# Altium schematic sheet Display_Driver.SchDoc
size 594 x 420 mm; SheetNumber: 3; SheetTotal: 4
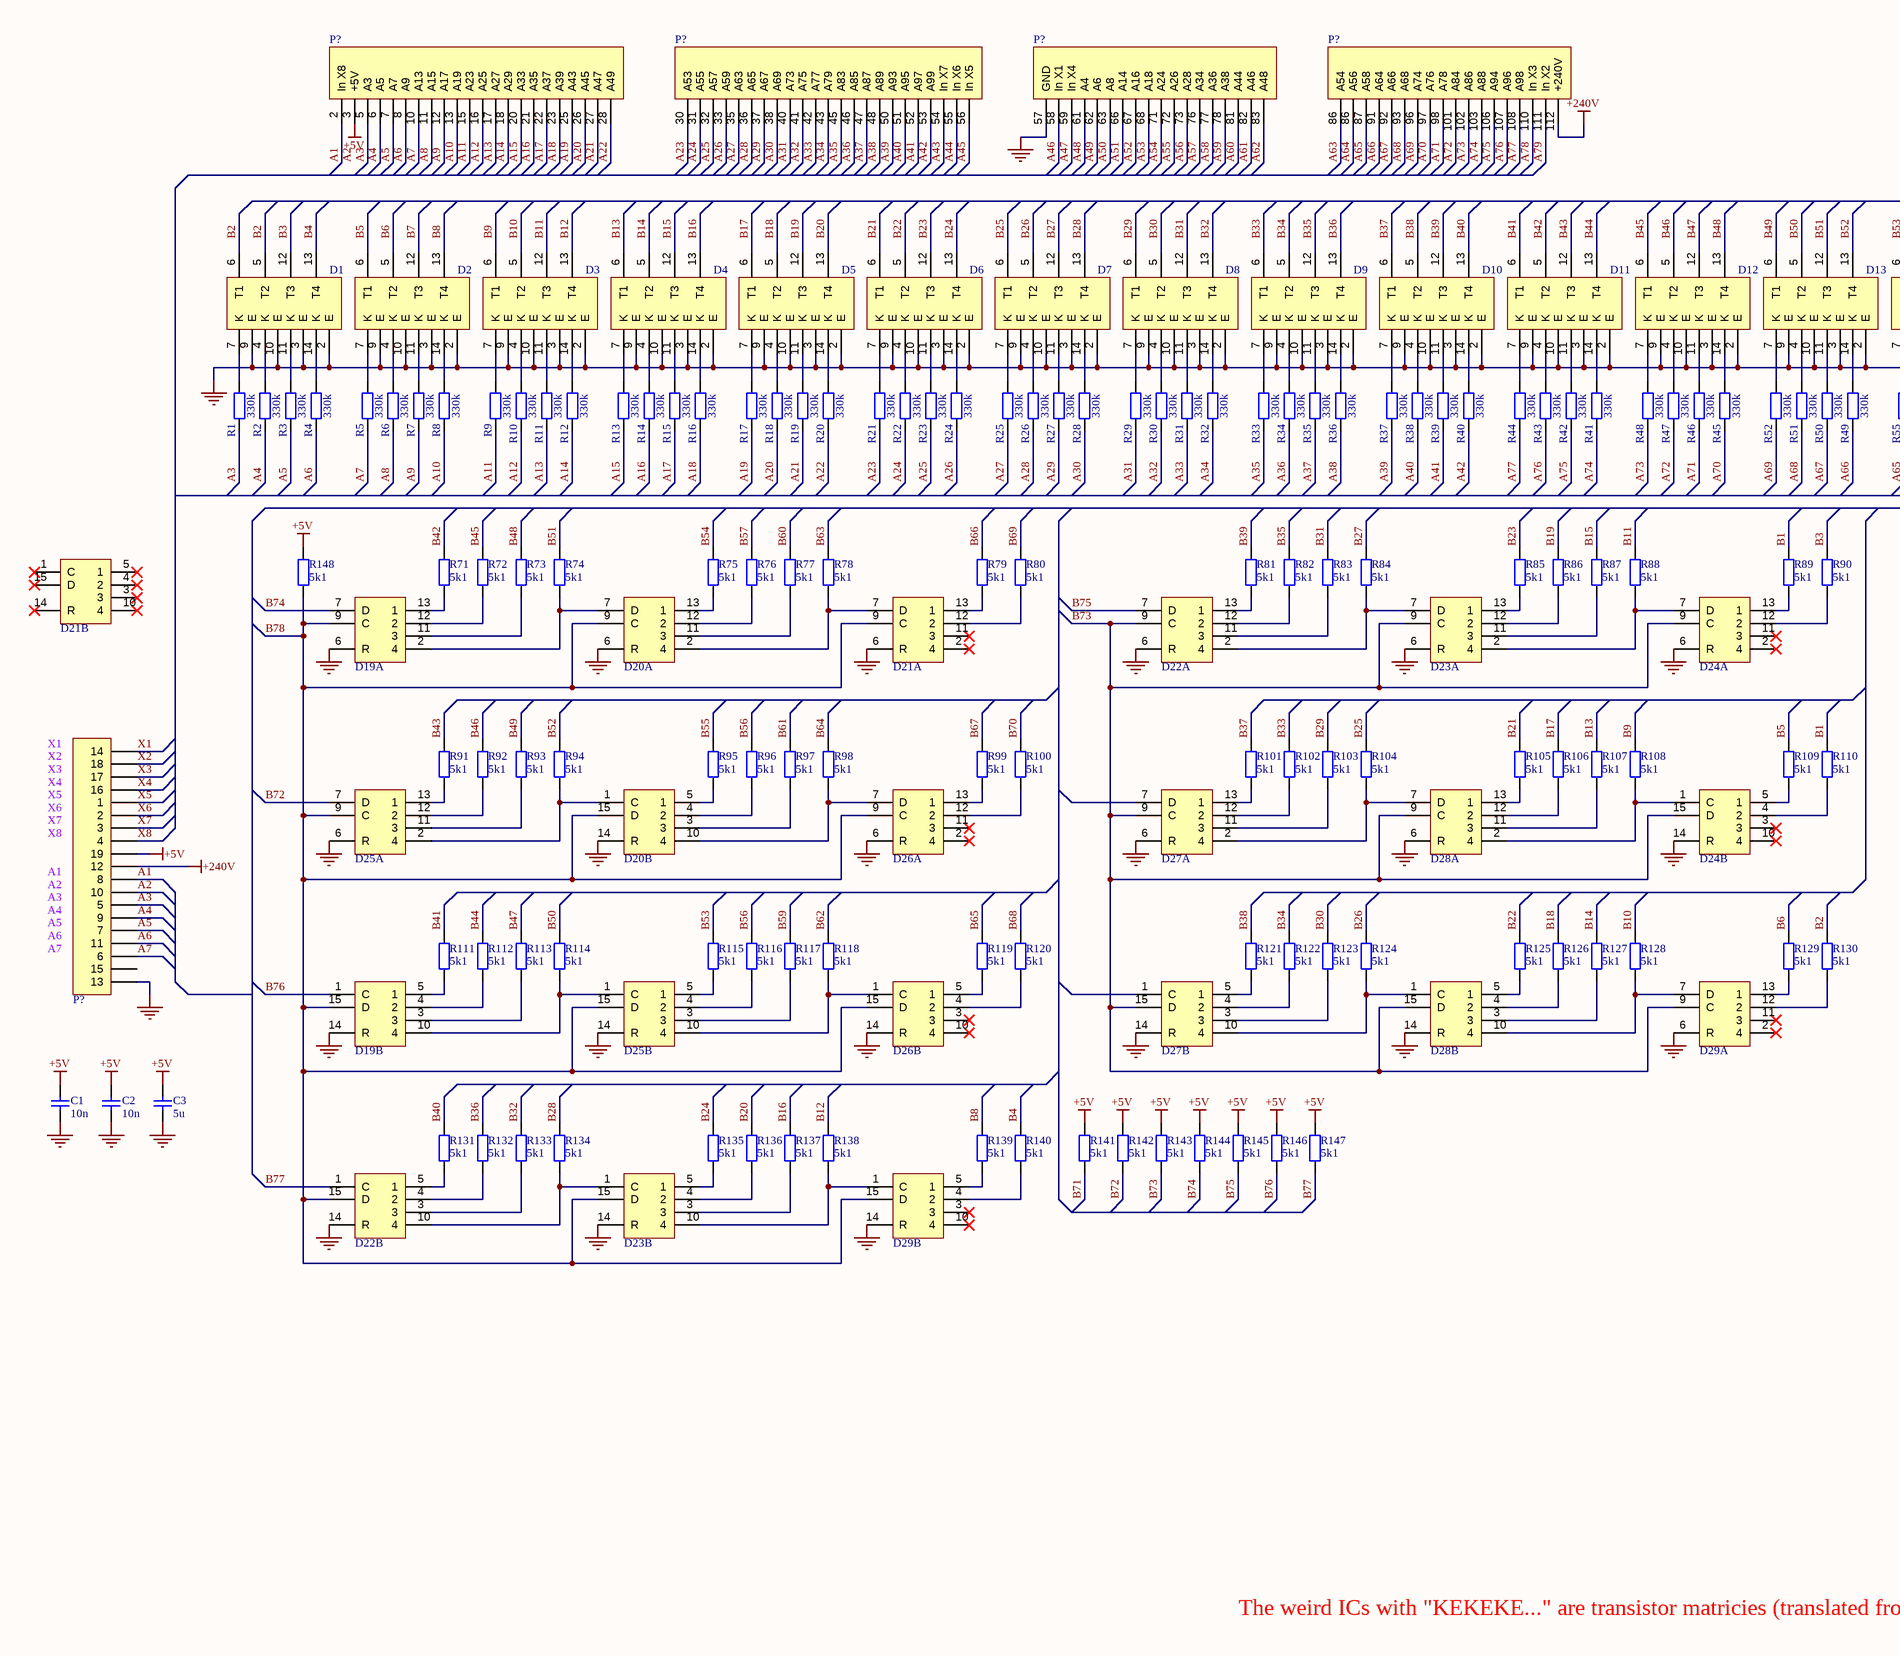
[diagram p0: Display_Driver.SchDoc, left]
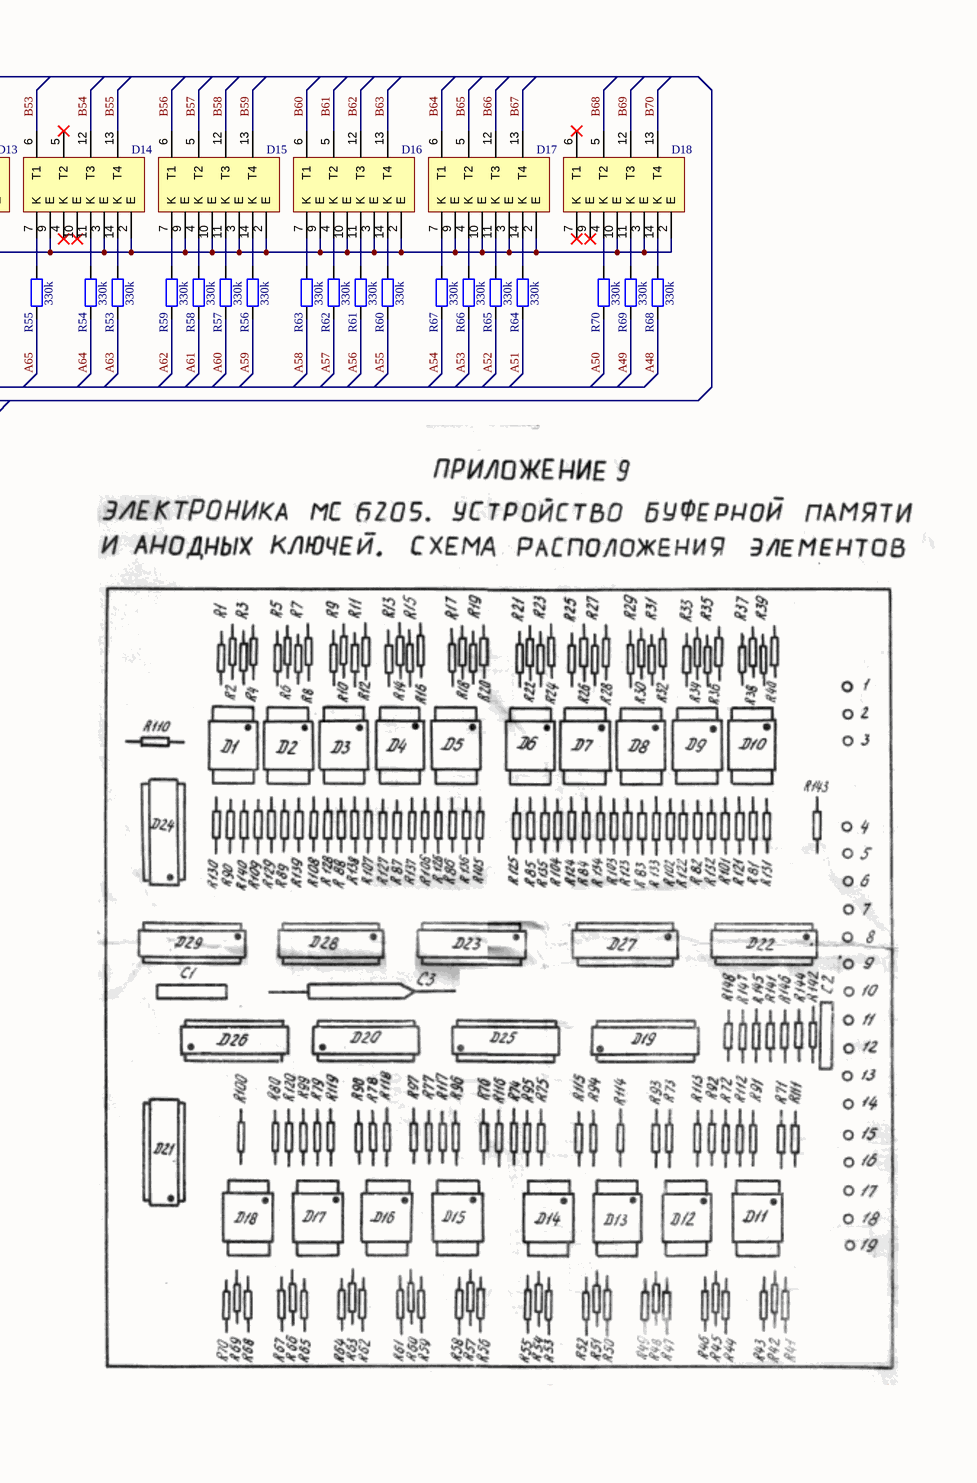
[diagram p1: Display_Driver.SchDoc, right]

## Parts
(Parts that share a designator on the sheet are numbered #1, #2 ... from top to bottom, then left to right.)
C1  10n
C2  10n
C3  5u
D1  -  (value not drawn)
D2  -  (value not drawn)
D3  -  (value not drawn)
D4  -  (value not drawn)
D5  -  (value not drawn)
D6  -  (value not drawn)
D7  -  (value not drawn)
D8  -  (value not drawn)
D9  -  (value not drawn)
D10  -  (value not drawn)
D11  -  (value not drawn)
D12  -  (value not drawn)
D13  -  (value not drawn)
D14  -  (value not drawn)
D15  -  (value not drawn)
D16  -  (value not drawn)
D17  -  (value not drawn)
D18  -  (value not drawn)
D19  -  (value not drawn)  (parts A,B of 2)
D20  -  (value not drawn)  (parts A,B of 2)
D21  -  (value not drawn)  (parts A,B of 2)
D22  -  (value not drawn)  (parts A,B of 2)
D23  -  (value not drawn)  (parts A,B of 2)
D24  -  (value not drawn)  (parts A,B of 2)
D25  -  (value not drawn)  (parts A,B of 2)
D26  -  (value not drawn)  (parts A,B of 2)
D27  -  (value not drawn)  (parts A,B of 2)
D28  -  (value not drawn)  (parts A,B of 2)
D29  -  (value not drawn)  (parts A,B of 2)
P?#1  -  (value not drawn)
P?#2  -  (value not drawn)
P?#3  -  (value not drawn)
P?#4  -  (value not drawn)
P?#5  -  (value not drawn)
R1  330k
R2  330k
R3  330k
R4  330k
R5  330k
R6  330k
R7  330k
R8  330k
R9  330k
R10  330k
R11  330k
R12  330k
R13  330k
R14  330k
R15  330k
R16  330k
R17  330k
R18  330k
R19  330k
R20  330k
R21  330k
R22  330k
R23  330k
R24  330k
R25  330k
R26  330k
R27  330k
R28  330k
R29  330k
R30  330k
R31  330k
R32  330k
R33  330k
R34  330k
R35  330k
R36  330k
R37  330k
R38  330k
R39  330k
R40  330k
R41  330k
R42  330k
R43  330k
R44  330k
R45  330k
R46  330k
R47  330k
R48  330k
R49  330k
R50  330k
R51  330k
R52  330k
R53  330k
R54  330k
R55  330k
R56  330k
R57  330k
R58  330k
R59  330k
R60  330k
R61  330k
R62  330k
R63  330k
R64  330k
R65  330k
R66  330k
R67  330k
R68  330k
R69  330k
R70  330k
R71  5k1
R72  5k1
R73  5k1
R74  5k1
R75  5k1
R76  5k1
R77  5k1
R78  5k1
R79  5k1
R80  5k1
R81  5k1
R82  5k1
R83  5k1
R84  5k1
R85  5k1
R86  5k1
R87  5k1
R88  5k1
R89  5k1
R90  5k1
R91  5k1
R92  5k1
R93  5k1
R94  5k1
R95  5k1
R96  5k1
R97  5k1
R98  5k1
R99  5k1
R100  5k1
R101  5k1
R102  5k1
R103  5k1
R104  5k1
R105  5k1
R106  5k1
R107  5k1
R108  5k1
R109  5k1
R110  5k1
R111  5k1
R112  5k1
R113  5k1
R114  5k1
R115  5k1
R116  5k1
R117  5k1
R118  5k1
R119  5k1
R120  5k1
R121  5k1
R122  5k1
R123  5k1
R124  5k1
R125  5k1
R126  5k1
R127  5k1
R128  5k1
R129  5k1
R130  5k1
R131  5k1
R132  5k1
R133  5k1
R134  5k1
R135  5k1
R136  5k1
R137  5k1
R138  5k1
R139  5k1
R140  5k1
R141  5k1
R142  5k1
R143  5k1
R144  5k1
R145  5k1
R146  5k1
R147  5k1
R148  5k1

## Nets
+5V: C1.1 C2.1 C3.1 P?#1.3(+5V) P?#5.19 R141.1 R142.1 R143.1 R144.1 R145.1 R146.1 R147.1 R148.2
+240V: P?#4.112(+240V) P?#5.12
GND: C1.2 C2.2 C3.2 D1.2(E) D1.3(E) D1.9(E) D1.10(E) D2.2(E) D2.3(E) D2.9(E) D2.10(E) D3.2(E) D3.3(E) D3.9(E) D3.10(E) D4.2(E) D4.3(E) D4.9(E) D4.10(E) D5.2(E) D5.3(E) D5.9(E) D5.10(E) D6.2(E) D6.3(E) D6.9(E) D6.10(E) D7.2(E) D7.3(E) D7.9(E) D7.10(E) D8.2(E) D8.3(E) D8.9(E) D8.10(E) D9.2(E) D9.3(E) D9.9(E) D9.10(E) D10.2(E) D10.3(E) D10.9(E) D10.10(E) D11.2(E) D11.3(E) D11.9(E) D11.10(E) D12.2(E) D12.3(E) D12.9(E) D12.10(E) D13.2(E) D13.3(E) D13.9(E) D13.10(E) D14.2(E) D14.3(E) D14.9(E) D15.2(E) D15.3(E) D15.9(E) D15.10(E) D16.2(E) D16.3(E) D16.9(E) D16.10(E) D17.2(E) D17.3(E) D17.9(E) D17.10(E) D18.2(E) D18.3(E) D18.10(E) D19.6(R) D19.14(R) D20.6(R) D20.14(R) D21.6(R) D22.6(R) D22.14(R) D23.6(R) D23.14(R) D24.6(R) D24.14(R) D25.6(R) D25.14(R) D26.6(R) D26.14(R) D27.6(R) D27.14(R) D28.6(R) D28.14(R) D29.6(R) D29.14(R) P?#3.57(GND) P?#5.13
A1: P?#1.2(In_X8) P?#5.8
A2: P?#5.10
A3: P?#1.5(A3) P?#5.5 R1.1
A4: P?#1.6(A5) P?#5.9 R2.1
A5: P?#1.7(A7) P?#5.7 R3.1
A6: P?#1.8(A9) P?#5.11 R4.1
A7: P?#1.10(A13) P?#5.6 R5.1
A8: P?#1.11(A15) R6.1
A9: P?#1.12(A17) R7.1
A10: P?#1.13(A19) R8.1
A11: P?#1.15(A23) R9.1
A12: P?#1.16(A25) R10.1
A13: P?#1.17(A27) R11.1
A14: P?#1.18(A29) R12.1
A15: P?#1.20(A33) R13.1
A16: P?#1.21(A35) R14.1
A17: P?#1.22(A37) R15.1
A18: P?#1.23(A39) R16.1
A19: P?#1.25(A43) R17.1
A20: P?#1.26(A45) R18.1
A21: P?#1.27(A47) R19.1
A22: P?#1.28(A49) R20.1
A23: P?#2.30(A53) R21.1
A24: P?#2.31(A55) R22.1
A25: P?#2.32(A57) R23.1
A26: P?#2.33(A59) R24.1
A27: P?#2.35(A63) R25.1
A28: P?#2.36(A65) R26.1
A29: P?#2.37(A67) R27.1
A30: P?#2.38(A69) R28.1
A31: P?#2.40(A73) R29.1
A32: P?#2.41(A75) R30.1
A33: P?#2.42(A77) R31.1
A34: P?#2.43(A79) R32.1
A35: P?#2.45(A83) R33.1
A36: P?#2.46(A85) R34.1
A37: P?#2.47(A87) R35.1
A38: P?#2.48(A89) R36.1
A39: P?#2.50(A93) R37.1
A40: P?#2.51(A95) R38.1
A41: P?#2.52(A97) R39.1
A42: P?#2.53(A99) R40.1
A43: P?#2.54(In_X7)
A44: P?#2.55(In_X6)
A45: P?#2.56(In_X5)
A46: P?#3.58(In_X1)
A47: P?#3.59(In_X4)
A48: P?#3.61(A4) R68.1
A49: P?#3.62(A6) R69.1
A50: P?#3.63(A8) R70.1
A51: P?#3.66(A14) R64.1
A52: P?#3.67(A16) R65.1
A53: P?#3.68(A18) R66.1
A54: P?#3.71(A24) R67.1
A55: P?#3.72(A26) R60.1
A56: P?#3.73(A28) R61.1
A57: P?#3.76(A34) R62.1
A58: P?#3.77(A36) R63.1
A59: P?#3.78(A38) R56.1
A60: P?#3.81(A44) R57.1
A61: P?#3.82(A46) R58.1
A62: P?#3.83(A48) R59.1
A63: P?#4.86(A54) R53.1
A64: P?#4.86(A56) R54.1
A65: P?#4.87(A58) R55.1
A66: P?#4.91(A64) R49.1
A67: P?#4.92(A66) R50.1
A68: P?#4.93(A68) R51.1
A69: P?#4.96(A74) R52.1
A70: P?#4.97(A76) R45.1
A71: P?#4.98(A78) R46.1
A72: P?#4.101(A84) R47.1
A73: P?#4.102(A86) R48.1
A74: P?#4.103(A88) R41.1
A75: P?#4.106(A94) R42.1
A76: P?#4.107(A96) R43.1
A77: P?#4.108(A98) R44.1
A78: P?#4.110(In_X3)
A79: P?#4.111(In_X2)
B1: R89.2 R110.2
B2: D1.5(T2) D1.6(T1) R130.2
B3: D1.12(T3) R90.2
B4: D1.13(T4) R140.2
B5: D2.6(T1) R109.2
B6: D2.5(T2) R129.2
B7: D2.12(T3)
B8: D2.13(T4) R139.2
B9: D3.6(T1) R108.2
B10: D3.5(T2) R128.2
B11: D3.12(T3) R88.2
B12: D3.13(T4) R138.2
B13: D4.6(T1) R107.2
B14: D4.5(T2) R127.2
B15: D4.12(T3) R87.2
B16: D4.13(T4) R137.2
B17: D5.6(T1) R106.2
B18: D5.5(T2) R126.2
B19: D5.12(T3) R86.2
B20: D5.13(T4) R136.2
B21: D6.6(T1) R105.2
B22: D6.5(T2) R125.2
B23: D6.12(T3) R85.2
B24: D6.13(T4) R135.2
B25: D7.6(T1) R104.2
B26: D7.5(T2) R124.2
B27: D7.12(T3) R84.2
B28: D7.13(T4) R134.2
B29: D8.6(T1) R103.2
B30: D8.5(T2) R123.2
B31: D8.12(T3) R83.2
B32: D8.13(T4) R133.2
B33: D9.6(T1) R102.2
B34: D9.5(T2) R122.2
B35: D9.12(T3) R82.2
B36: D9.13(T4) R132.2
B37: D10.6(T1) R101.2
B38: D10.5(T2) R121.2
B39: D10.12(T3) R81.2
B40: D10.13(T4) R131.2
B41: D11.6(T1) R111.2
B42: D11.5(T2) R71.2
B43: D11.12(T3) R91.2
B44: D11.13(T4) R112.2
B45: D12.6(T1) R72.2
B46: D12.5(T2) R92.2
B47: D12.12(T3) R113.2
B48: D12.13(T4) R73.2
B49: D13.6(T1) R93.2
B50: D13.5(T2) R114.2
B51: D13.12(T3) R74.2
B52: D13.13(T4) R94.2
B53: D14.6(T1) R115.2
B54: D14.12(T3) R75.2
B55: D14.13(T4) R95.2
B56: D15.6(T1) R96.2 R116.2
B57: D15.5(T2) R76.2
B58: D15.12(T3)
B59: D15.13(T4) R117.2
B60: D16.6(T1) R77.2
B61: D16.5(T2) R97.2
B62: D16.12(T3) R118.2
B63: D16.13(T4) R78.2
B64: D17.6(T1) R98.2
B65: D17.5(T2) R119.2
B66: D17.12(T3) R79.2
B67: D17.13(T4) R99.2
B68: D18.5(T2) R120.2
B69: D18.12(T3) R80.2
B70: D18.13(T4) R100.2
B71: R141.2
B72: D25.7(D) R142.2
B73: D22.9(C) D23.9(C) D24.9(C) D24.15(D) D27.9(C) D27.15(D) D28.9(C) D28.15(D) D29.9(C) R143.2
B74: D19.7(D) R144.2
B75: D22.7(D) R145.2
B76: D19.1(C) R146.2
B77: D22.1(C) R147.2
B78: D19.9(C) D19.15(D) D20.9(C) D20.15(D) D21.9(C) D22.15(D) D23.15(D) D25.9(C) D25.15(D) D26.9(C) D26.15(D) D29.15(D) R148.1
X1: P?#5.14
X2: P?#5.18
X3: P?#5.17
X4: P?#5.16
X5: P?#5.1
X6: P?#5.2
X7: P?#5.3
X8: P?#5.4
NetD1_4: D1.4(K) R2.2
NetD1_7: D1.7(K) R1.2
NetD1_11: D1.11(K) R3.2
NetD1_14: D1.14(K) R4.2
NetD2_4: D2.4(K) R6.2
NetD2_7: D2.7(K) R5.2
NetD2_11: D2.11(K) R7.2
NetD2_14: D2.14(K) R8.2
NetD3_4: D3.4(K) R10.2
NetD3_7: D3.7(K) R9.2
NetD3_11: D3.11(K) R11.2
NetD3_14: D3.14(K) R12.2
NetD4_4: D4.4(K) R14.2
NetD4_7: D4.7(K) R13.2
NetD4_11: D4.11(K) R15.2
NetD4_14: D4.14(K) R16.2
NetD5_4: D5.4(K) R18.2
NetD5_7: D5.7(K) R17.2
NetD5_11: D5.11(K) R19.2
NetD5_14: D5.14(K) R20.2
NetD6_4: D6.4(K) R22.2
NetD6_7: D6.7(K) R21.2
NetD6_11: D6.11(K) R23.2
NetD6_14: D6.14(K) R24.2
NetD7_4: D7.4(K) R26.2
NetD7_7: D7.7(K) R25.2
NetD7_11: D7.11(K) R27.2
NetD7_14: D7.14(K) R28.2
NetD8_4: D8.4(K) R30.2
NetD8_7: D8.7(K) R29.2
NetD8_11: D8.11(K) R31.2
NetD8_14: D8.14(K) R32.2
NetD9_4: D9.4(K) R34.2
NetD9_7: D9.7(K) R33.2
NetD9_11: D9.11(K) R35.2
NetD9_14: D9.14(K) R36.2
NetD10_4: D10.4(K) R38.2
NetD10_7: D10.7(K) R37.2
NetD10_11: D10.11(K) R39.2
NetD10_14: D10.14(K) R40.2
NetD11_4: D11.4(K) R43.2
NetD11_7: D11.7(K) R44.2
NetD11_11: D11.11(K) R42.2
NetD11_14: D11.14(K) R41.2
NetD12_4: D12.4(K) R47.2
NetD12_7: D12.7(K) R48.2
NetD12_11: D12.11(K) R46.2
NetD12_14: D12.14(K) R45.2
NetD13_4: D13.4(K) R51.2
NetD13_7: D13.7(K) R52.2
NetD13_11: D13.11(K) R50.2
NetD13_14: D13.14(K) R49.2
NetD14_7: D14.7(K) R55.2
NetD14_11: D14.11(K) R54.2
NetD14_14: D14.14(K) R53.2
NetD15_4: D15.4(K) R58.2
NetD15_7: D15.7(K) R59.2
NetD15_11: D15.11(K) R57.2
NetD15_14: D15.14(K) R56.2
NetD16_4: D16.4(K) R62.2
NetD16_7: D16.7(K) R63.2
NetD16_11: D16.11(K) R61.2
NetD16_14: D16.14(K) R60.2
NetD17_4: D17.4(K) R66.2
NetD17_7: D17.7(K) R67.2
NetD17_11: D17.11(K) R65.2
NetD17_14: D17.14(K) R64.2
NetD18_4: D18.4(K) R70.2
NetD18_11: D18.11(K) R69.2
NetD18_14: D18.14(K) R68.2
NetD19_2: D19.2(4) D20.7(D) R74.1
NetD19_3: D19.3 R113.1
NetD19_4: D19.4(2) R112.1
NetD19_5: D19.5(1) R111.1
NetD19_10: D19.10(4) D25.1(C) R114.1
NetD19_11: D19.11(3) R73.1
NetD19_12: D19.12(2) R72.1
NetD19_13: D19.13(1) R71.1
NetD20_1: D20.1(C) D25.2(4) R94.1
NetD20_2: D20.2(4) D21.7(D) R78.1
NetD20_3: D20.3 R97.1
NetD20_4: D20.4(2) R96.1
NetD20_5: D20.5(1) R95.1
NetD20_10: D20.10(4) D26.7(D) R98.1
NetD20_11: D20.11(3) R77.1
NetD20_12: D20.12(2) R76.1
NetD20_13: D20.13(1) R75.1
NetD21_12: D21.12(2) R80.1
NetD21_13: D21.13(1) R79.1
NetD22_2: D22.2(4) D23.7(D) R84.1
NetD22_3: D22.3 R133.1
NetD22_4: D22.4(2) R132.1
NetD22_5: D22.5(1) R131.1
NetD22_10: D22.10(4) D23.1(C) R134.1
NetD22_11: D22.11(3) R83.1
NetD22_12: D22.12(2) R82.1
NetD22_13: D22.13(1) R81.1
NetD23_2: D23.2(4) D24.7(D) R88.1
NetD23_3: D23.3 R137.1
NetD23_4: D23.4(2) R136.1
NetD23_5: D23.5(1) R135.1
NetD23_10: D23.10(4) D29.1(C) R138.1
NetD23_11: D23.11(3) R87.1
NetD23_12: D23.12(2) R86.1
NetD23_13: D23.13(1) R85.1
NetD24_1: D24.1(C) D28.2(4) R108.1
NetD24_4: D24.4(2) R110.1
NetD24_5: D24.5(1) R109.1
NetD24_12: D24.12(2) R90.1
NetD24_13: D24.13(1) R89.1
NetD25_3: D25.3 R117.1
NetD25_4: D25.4(2) R116.1
NetD25_5: D25.5(1) R115.1
NetD25_10: D25.10(4) D26.1(C) R118.1
NetD25_11: D25.11(3) R93.1
NetD25_12: D25.12(2) R92.1
NetD25_13: D25.13(1) R91.1
NetD26_4: D26.4(2) R120.1
NetD26_5: D26.5(1) R119.1
NetD26_12: D26.12(2) R100.1
NetD26_13: D26.13(1) R99.1
NetD27_2: D27.2(4) D28.7(D) R104.1
NetD27_3: D27.3 R123.1
NetD27_4: D27.4(2) R122.1
NetD27_5: D27.5(1) R121.1
NetD27_10: D27.10(4) D28.1(C) R124.1
NetD27_11: D27.11(3) R103.1
NetD27_12: D27.12(2) R102.1
NetD27_13: D27.13(1) R101.1
NetD28_3: D28.3 R127.1
NetD28_4: D28.4(2) R126.1
NetD28_5: D28.5(1) R125.1
NetD28_10: D28.10(4) D29.7(D) R128.1
NetD28_11: D28.11(3) R107.1
NetD28_12: D28.12(2) R106.1
NetD28_13: D28.13(1) R105.1
NetD29_4: D29.4(2) R140.1
NetD29_5: D29.5(1) R139.1
NetD29_12: D29.12(2) R130.1
NetD29_13: D29.13(1) R129.1

Not connected (* = marked no-connect by the designer): D14 4(K)* 5(T2)* 10(E)*; D18 6(T1)* 7(K)* 9(E)*; D21 1(C)* 2(4)* 3* 4(2)* 5(1)* 10(4)* 11(3)* 14(R)* 15(D)*; D24 2(4)* 3* 10(4)* 11(3)*; D26 2(4)* 3* 10(4)* 11(3)*; D27 1(C) 7(D); D29 2(4)* 3* 10(4)* 11(3)*; P?#5 15

## Notes on the sheet
- X1
- X2
- X3
- X4
- X5
- X6
- X7
- X8
- A1
- A2
- A3
- A4
- A5
- A6
- A7
- The weird ICs with "KEKEKE..." are transistor matricies (translated from the BOM on the right).
- Labels drawn without touching a wire or pin: A2
- DWG NO:
- REV:
- REVISION
- DESCRIPTION
- DATE
- APPROVED
- ENG:
- APPROVALS
- PROJECT
- DSN:
- CHK:
- REFERENCE DOCUMENTS
- PROJECT REVISION:
- TITLE
- DOCUMENT REVISION:
- DESIGN ITEM:
- BOM:
- FAB DWG:
- PCB DWG:
- ASSY DWG:
- SCALE:
- SIZE
- CAGE CODE
- FILE NAME
- DWG NO.
- SHEET
- OF
- REV

## Library data of the parts
C1-C3 = C
D1-D18 = Transistor_Matrix
D19-D29 = К561ИР2: 4-bit shift register - https://www.microshemca.ru/M.K561IR2/
P?#1 = Disp_Connector_a
P?#2 = Disp_Connector_b
P?#3 = Disp_Connector_c
P?#4 = Disp_Connector_d
P?#5 = 19x1_Connector_b
R1-R148 = R